# Altium schematic sheet Sallen_key_bandpass.SchDoc
size A
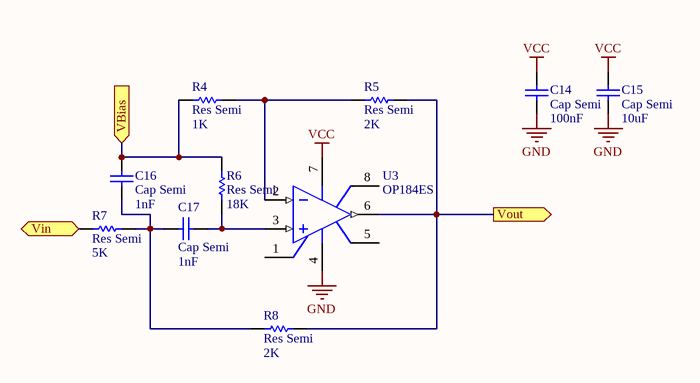
[diagram p0: Sallen_key_bandpass.SchDoc]

## Parts
C14  Cap Semi  value 100nF  [C0805]
C15  Cap Semi  value 10uF  [C1206]
C16  Cap Semi  value 1nF  [C0805]
C17  Cap Semi  value 1nF  [C0805]
R4  Res Semi  value 1K  [6-0805_M]
R5  Res Semi  value 2K  [6-0805_M]
R6  Res Semi  value 18K  [6-0805_M]
R7  Res Semi  value 5K  [6-0805_M]
R8  Res Semi  value 2K  [6-0805_M]
U3  OP184ES  [SO-8]

## Ports
VBias (in), Vin, Vout (out)

## Nets
GND: C14.1 C15.1 U3.4(V-)
VCC: C14.2 C15.2 U3.7(V+)
VBias: C16.2 R4.1 R6.2 ; port VBias
Vin: R7.1 ; port Vin
Vout: R5.2 R8.2 U3.6(OUT) ; port Vout
NetC16_1: C16.1 C17.2 R7.2 R8.1
NetC17_1: C17.1 R6.1 U3.3(IN+)
NetR4_2: R4.2 R5.1 U3.2(IN-)

Not connected (* = marked no-connect by the designer): U3 1(NUL) 5(NUL) 8(NC)

## Library data of the parts
C14 C15 = Cap Semi: Capacitor (Semiconductor SIM Model); Published: 8-Jun-2000; LatestRevisionDate: 29-May-2009; LatestRevisionNote: IPC-7351 Footprint Added.; PackageReference: C1206; Publisher: Altium Limited; PackageDescription: Chip Capacitor
C16 = Cap Semi: Capacitor (Semiconductor SIM Model); Low-pass filter value: OPEN; Published: 8-Jun-2000; LatestRevisionDate: 29-May-2009; LatestRevisionNote: IPC-7351 Footprint Added.; PackageReference: C1206; Publisher: Altium Limited; PackageDescription: Chip Capacitor
C17 = Cap Semi: Capacitor (Semiconductor SIM Model); Low-pass filter value: R = 5K; Published: 8-Jun-2000; LatestRevisionDate: 29-May-2009; LatestRevisionNote: IPC-7351 Footprint Added.; PackageReference: C1206; Publisher: Altium Limited; PackageDescription: Chip Capacitor
R4 = Res Semi: Semiconductor Resistor; Low-pass filter value: OPEN; Published: 8-Jun-2000; LatestRevisionDate: 17-Jul-2002; LatestRevisionNote: Re-released for DXP Platform.; PackageReference: AXIAL-0.5; Publisher: Altium Limited
R5 = Res Semi: Semiconductor Resistor; Low-pass filter value: SHORT; Published: 8-Jun-2000; LatestRevisionDate: 17-Jul-2002; LatestRevisionNote: Re-released for DXP Platform.; PackageReference: AXIAL-0.5; Publisher: Altium Limited
R6 R8 = Res Semi: Semiconductor Resistor; Low-pass filter value: C = 120pF; Published: 8-Jun-2000; LatestRevisionDate: 17-Jul-2002; LatestRevisionNote: Re-released for DXP Platform.; PackageReference: AXIAL-0.5; Publisher: Altium Limited
R7 = Res Semi: Semiconductor Resistor; Low-pass filter value: R = 5k; Published: 8-Jun-2000; LatestRevisionDate: 17-Jul-2002; LatestRevisionNote: Re-released for DXP Platform.; PackageReference: AXIAL-0.5; Publisher: Altium Limited
U3 = OP184ES: Precision Rail-to-Rail Input and Ouput Operational Amplifier; Note: Pin 8 is not connected.; Published: 8-Jun-2000; LatestRevisionDate: 13-Apr-2006; LatestRevisionNote: IPC-7351 Footprint Added.; PackageVersion: revA; PackageReference: SO-8; Publisher: Altium Limited; PackageDescription: 8-Pin Small Outline Integrated Circuit 1.27 mm Pitch; Code_JEDEC: MS-012-AA; Code_IPC: SOIC127P600-8; Datasheet: http://www.analog.com/static/imported-files/data_sheets/OP184_284_484.pdf